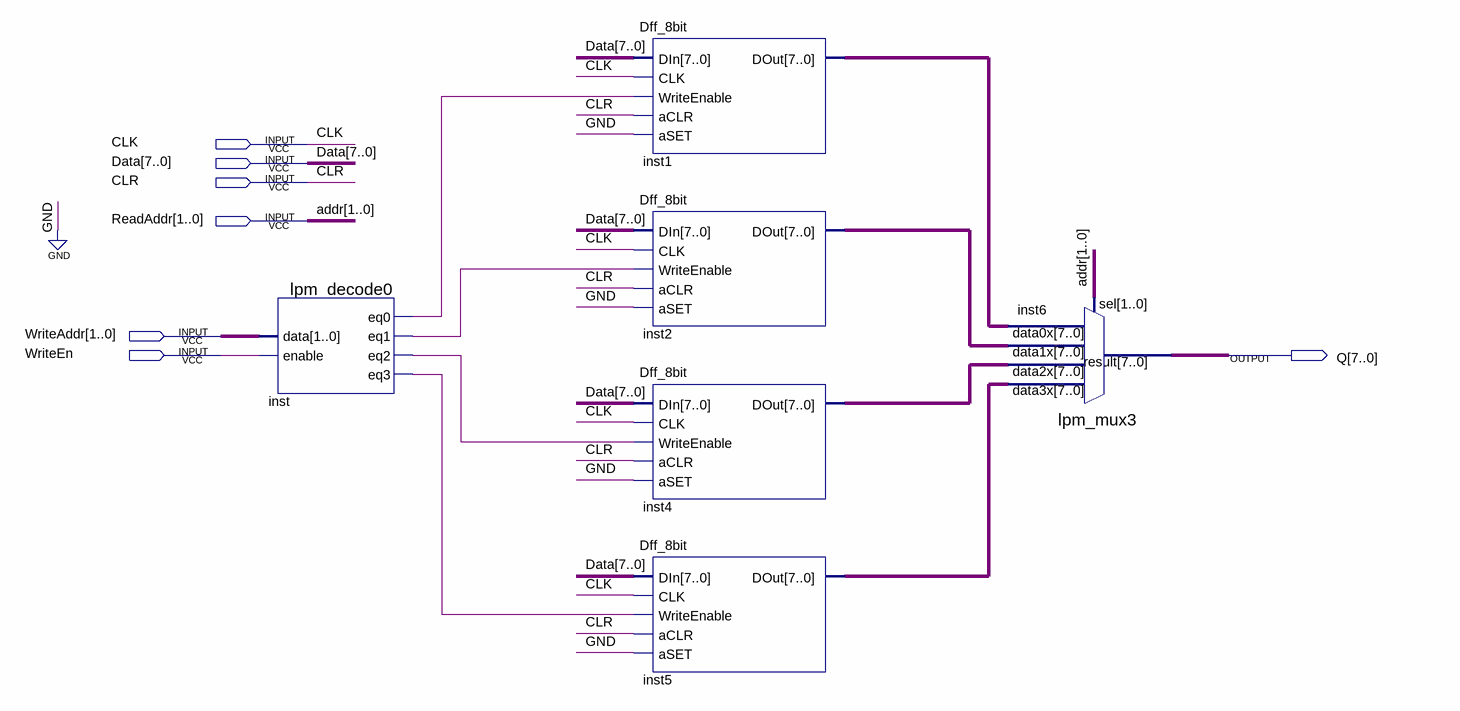
[diagram p0: schematic sheet]
// Quartus schematic REGs.bdf as structural Verilog: 6 symbols, 7 pins
module REGs (
  input  CLK,
  input  [7:0] Data,
  input  CLR,
  input  [1:0] ReadAddr,
  input  [1:0] WriteAddr,
  input  WriteEn,
  output [7:0] Q
);

  wire inst_eq0, inst_eq1, inst_eq2, inst_eq3;
  wire [7:0] inst1_dout, inst2_dout, inst4_dout, inst5_dout;

  lpm_decode0 inst (.data(WriteAddr), .enable(WriteEn), .eq0(inst_eq0), .eq1(inst_eq1), .eq2(inst_eq2), .eq3(inst_eq3));
  Dff_8bit inst1 (.DIn(Data), .CLK(CLK), .WriteEnable(inst_eq0), .aCLR(CLR), .aSET(1'b0), .DOut(inst1_dout));
  Dff_8bit inst2 (.DIn(Data), .CLK(CLK), .WriteEnable(inst_eq1), .aCLR(CLR), .aSET(1'b0), .DOut(inst2_dout));
  Dff_8bit inst4 (.DIn(Data), .CLK(CLK), .WriteEnable(inst_eq2), .aCLR(CLR), .aSET(1'b0), .DOut(inst4_dout));
  Dff_8bit inst5 (.DIn(Data), .CLK(CLK), .WriteEnable(inst_eq3), .aCLR(CLR), .aSET(1'b0), .DOut(inst5_dout));
  lpm_mux3 inst6 (
    .data3x(inst5_dout), .data2x(inst4_dout), .data1x(inst2_dout), .data0x(inst1_dout), .sel(ReadAddr),
    .result(Q));

  // Other names for the same wires on the sheet: addr[1:0] = ReadAddr
endmodule
